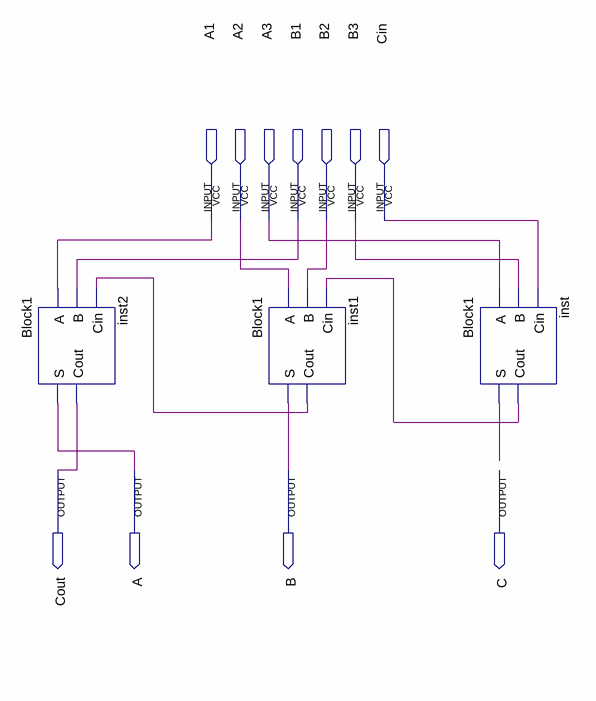
[diagram p0: schematic sheet]
// Quartus schematic somador_3.bdf as structural Verilog: 3 symbols, 11 pins
module somador_3 (
  input  A1,
  input  A2,
  input  A3,
  input  B1,
  input  B2,
  input  B3,
  input  Cin,
  output Cout,
  output A,
  output B,
  output C
);

  wire inst1_cout, inst_cout, inst_s;

  Block1 inst2 (.A(A1), .B(B1), .Cin(inst1_cout), .S(A), .Cout(Cout));
  Block1 inst1 (.A(A2), .B(B2), .Cin(inst_cout), .S(B), .Cout(inst1_cout));
  Block1 inst (.A(A3), .B(B3), .Cin(Cin), .S(inst_s), .Cout(inst_cout));
endmodule
